# Altium project kicanka_PCB.PrjPcb
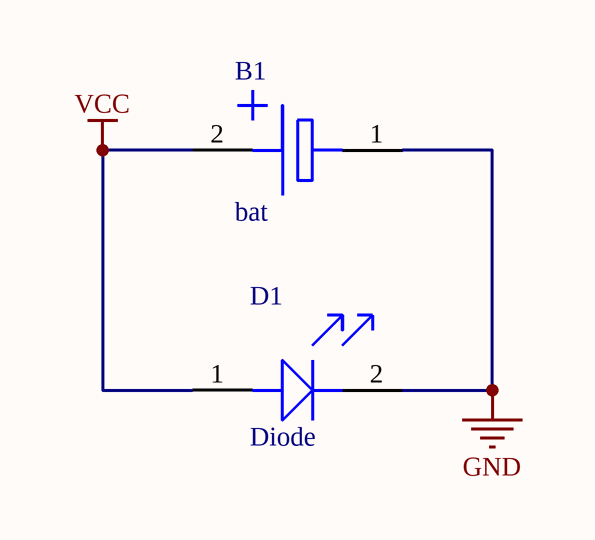
[diagram p0: kicanka_PCB.SchDoc]
1 sheet, 2 parts. Net scope: global (net labels, ports and power ports of the same name join across sheets).
Board file: kicanka_PCB.PcbDoc

## Sheet kicanka_PCB.SchDoc
size A3

### Parts
B1  bat  [bat]
D1  Diode  [LED]

### Nets
GND: B1.1 D1.2
VCC: B1.2 D1.1